# EAGLE design TDFN-14_with_EP_to_DIP-15 (EAGLE 8.5.1)
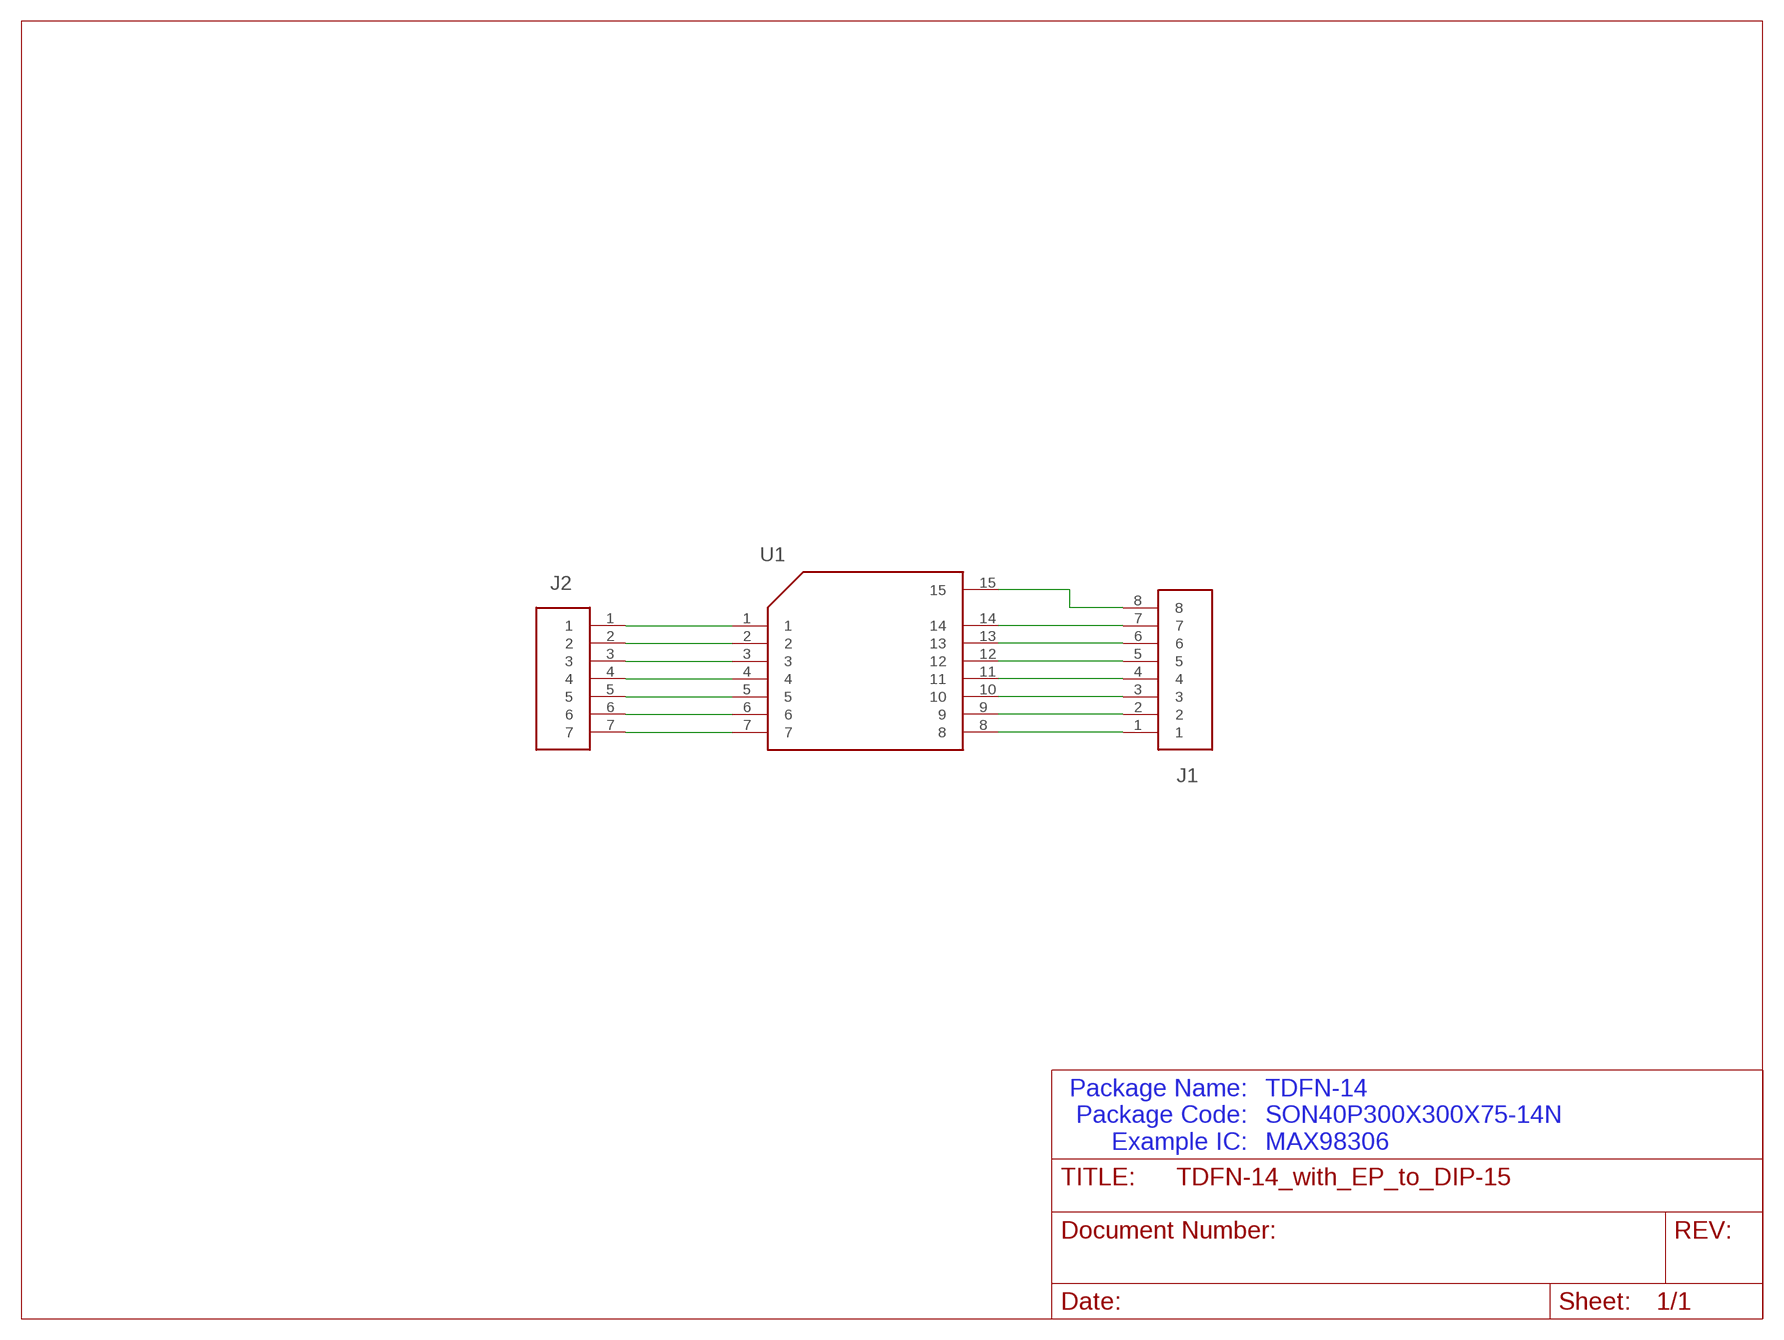
[diagram p0: schematic, sheet 1]

## Parts
J1  CONNECTOR_8-NO_SQUARE  [68000-108HLF-NO-SQUARE]
J2  CONNECTOR_7  [68000-107HLF]
U1  IC_GENERIC_14_PLUS_EP-DFN-14_PLUS_EP  [SON40P300X300X75-14N]

## Nets
N$1: J1.1 U1.8
N$2: J1.2 U1.9
N$3: J1.3 U1.10
N$4: J1.4 U1.11
N$5: J1.5 U1.12
N$6: J1.6 U1.13
N$7: J1.7 U1.14
N$8: J1.8 U1.15
N$9: J2.1 U1.1
N$10: J2.2 U1.2
N$11: J2.3 U1.3
N$12: J2.4 U1.4
N$13: J2.5 U1.5
N$14: J2.6 U1.6
N$15: J2.7 U1.7

## Notes on the sheet
- Package Name:
  Package Code:
  Example IC:
- TDFN-14
  SON40P300X300X75-14N
  MAX98306

## Library data of the parts
J1 = SnapEDA:CONNECTOR_8
J2 = SnapEDA:CONNECTOR_7
U1 = SnapEDA:IC_GENERIC_14_PLUS_EP

## Board
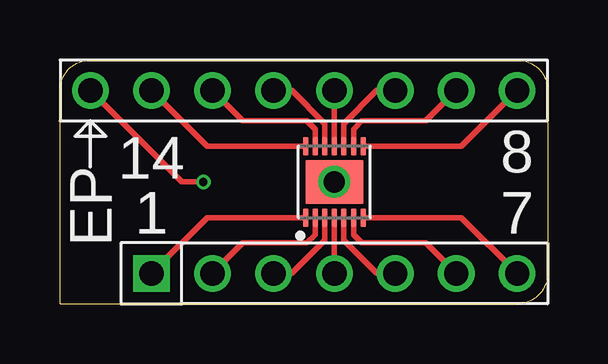
[diagram p1: board, top side]
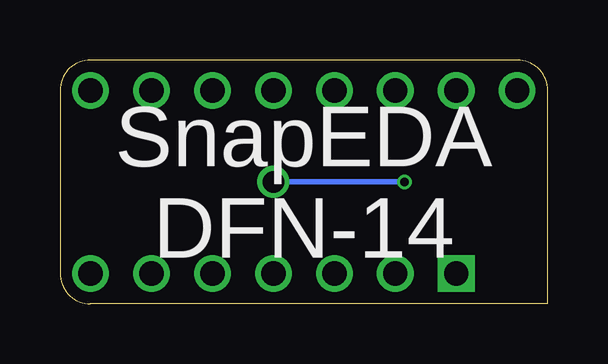
[diagram p2: board, bottom side, seen from below]

Size 20.32 x 10.16 mm. Coordinates in mm from the lower left corner, seen from the top.
Outline: 0,0 0,8.89 arc-90 1.27,10.16 19.05,10.16 arc-90 20.32,8.89 20.32,1.27 arc-90 19.05,0 0,0
Copper layers (1*16): Top 0.035559375mm / dielectric 1.6mm / Bottom 0.035559375mm
Design rules "oshpark-2layer *": minimum track width 6mil, minimum drill 10mil, track to track 6mil, track to pad 6mil, pad to pad 6mil, via to via 6mil, smd to smd 6mil, copper to edge 15mil, drill to drill 6mil, minimum pad ring 5mil, minimum via ring 5mil, stop-mask expansion 2.5mil, vias tented up to drill 0mil, thermal gap 10mil

### Footprints (pad centres in the part's own frame; a part is rotated, then mirrored left to right if it is on the bottom)
68000-108HLF-NO-SQUARE = drill 1.016: 1 0,0; 2 2.54,0; 3 5.08,0; 4 7.62,0; 5 10.16,0; 6 12.7,0; 7 15.24,0; 8 17.78,0
68000-107HLF = drill 1.016 square: 1 0,0 | drill 1.016: 2 2.54,0; 3 5.08,0; 4 7.62,0; 5 10.16,0; 6 12.7,0; 7 15.24,0
SON40P300X300X75-14N = smd 0.76 x 0.22: 1 -1.485,1.2; 2 -1.485,0.8; 3 -1.485,0.4; 4 -1.485,0; 5 -1.485,-0.4; 6 -1.485,-0.8; 7 -1.485,-1.2; 8 1.485,-1.2; 9 1.485,-0.8; 10 1.485,-0.4; 11 1.485,0; 12 1.485,0.4; 13 1.485,0.8; 14 1.485,1.2 | smd 1.81 x 2.4: 15 0,0

### Placement (x,y rotation side)
J1  19.05,8.89 180 top
J2  3.81,1.27 0 top
U1  11.43,5.08 90 top

### Tracks (layer width: path | path; a pad name or v marks a point on that pad's centre or on a via)
N$1
  Top 0.229: U1.8 16.73,6.57 J1.1
N$2
  Top 0.229: U1.9 12.23,7.28 12.57,7.62 15.24,7.62 J1.2
N$3
  Top 0.229: U1.10 11.83,7.51 13.21,8.89 J1.3
N$4
  Top 0.229: U1.11 J1.4
N$5
  Top 0.229: U1.12 11.03,7.51 9.65,8.89 J1.5
N$6
  Top 0.229: U1.13 10.63,7.28 10.29,7.62 7.62,7.62 J1.6
N$7
  Top 0.229: U1.14 6.13,6.57 J1.7
N$8  (via drill 0.35, 0.89)
  Top 0.229: J1.8 5.08,5.08 v5.97,5.08 | U1.15 12.06,5.08
  Bottom 0.229: v5.97,5.08 U1.15
  other vias: 11.43,5.08
N$9
  Top 0.229: U1.1 6.13,3.6 J2.1
N$10
  Top 0.229: U1.2 10.63,2.88 10.29,2.54 7.62,2.54 J2.2
N$11
  Top 0.229: U1.3 11.03,2.65 9.65,1.27 J2.3
N$12
  Top 0.229: U1.4 J2.4
N$13
  Top 0.229: U1.5 11.83,2.65 13.21,1.27 J2.5
N$14
  Top 0.229: U1.6 12.23,2.88 12.57,2.54 15.24,2.54 J2.6
N$15
  Top 0.229: U1.7 16.73,3.6 J2.7

### Text on the board
tPlace: 14 | 8 | EP | 1 | 7
bPlace: SnapEDA / DFN-14